# Altium schematic sheet Uno.SchDoc
size A2; SheetNumber: 1; SheetTotal: 1
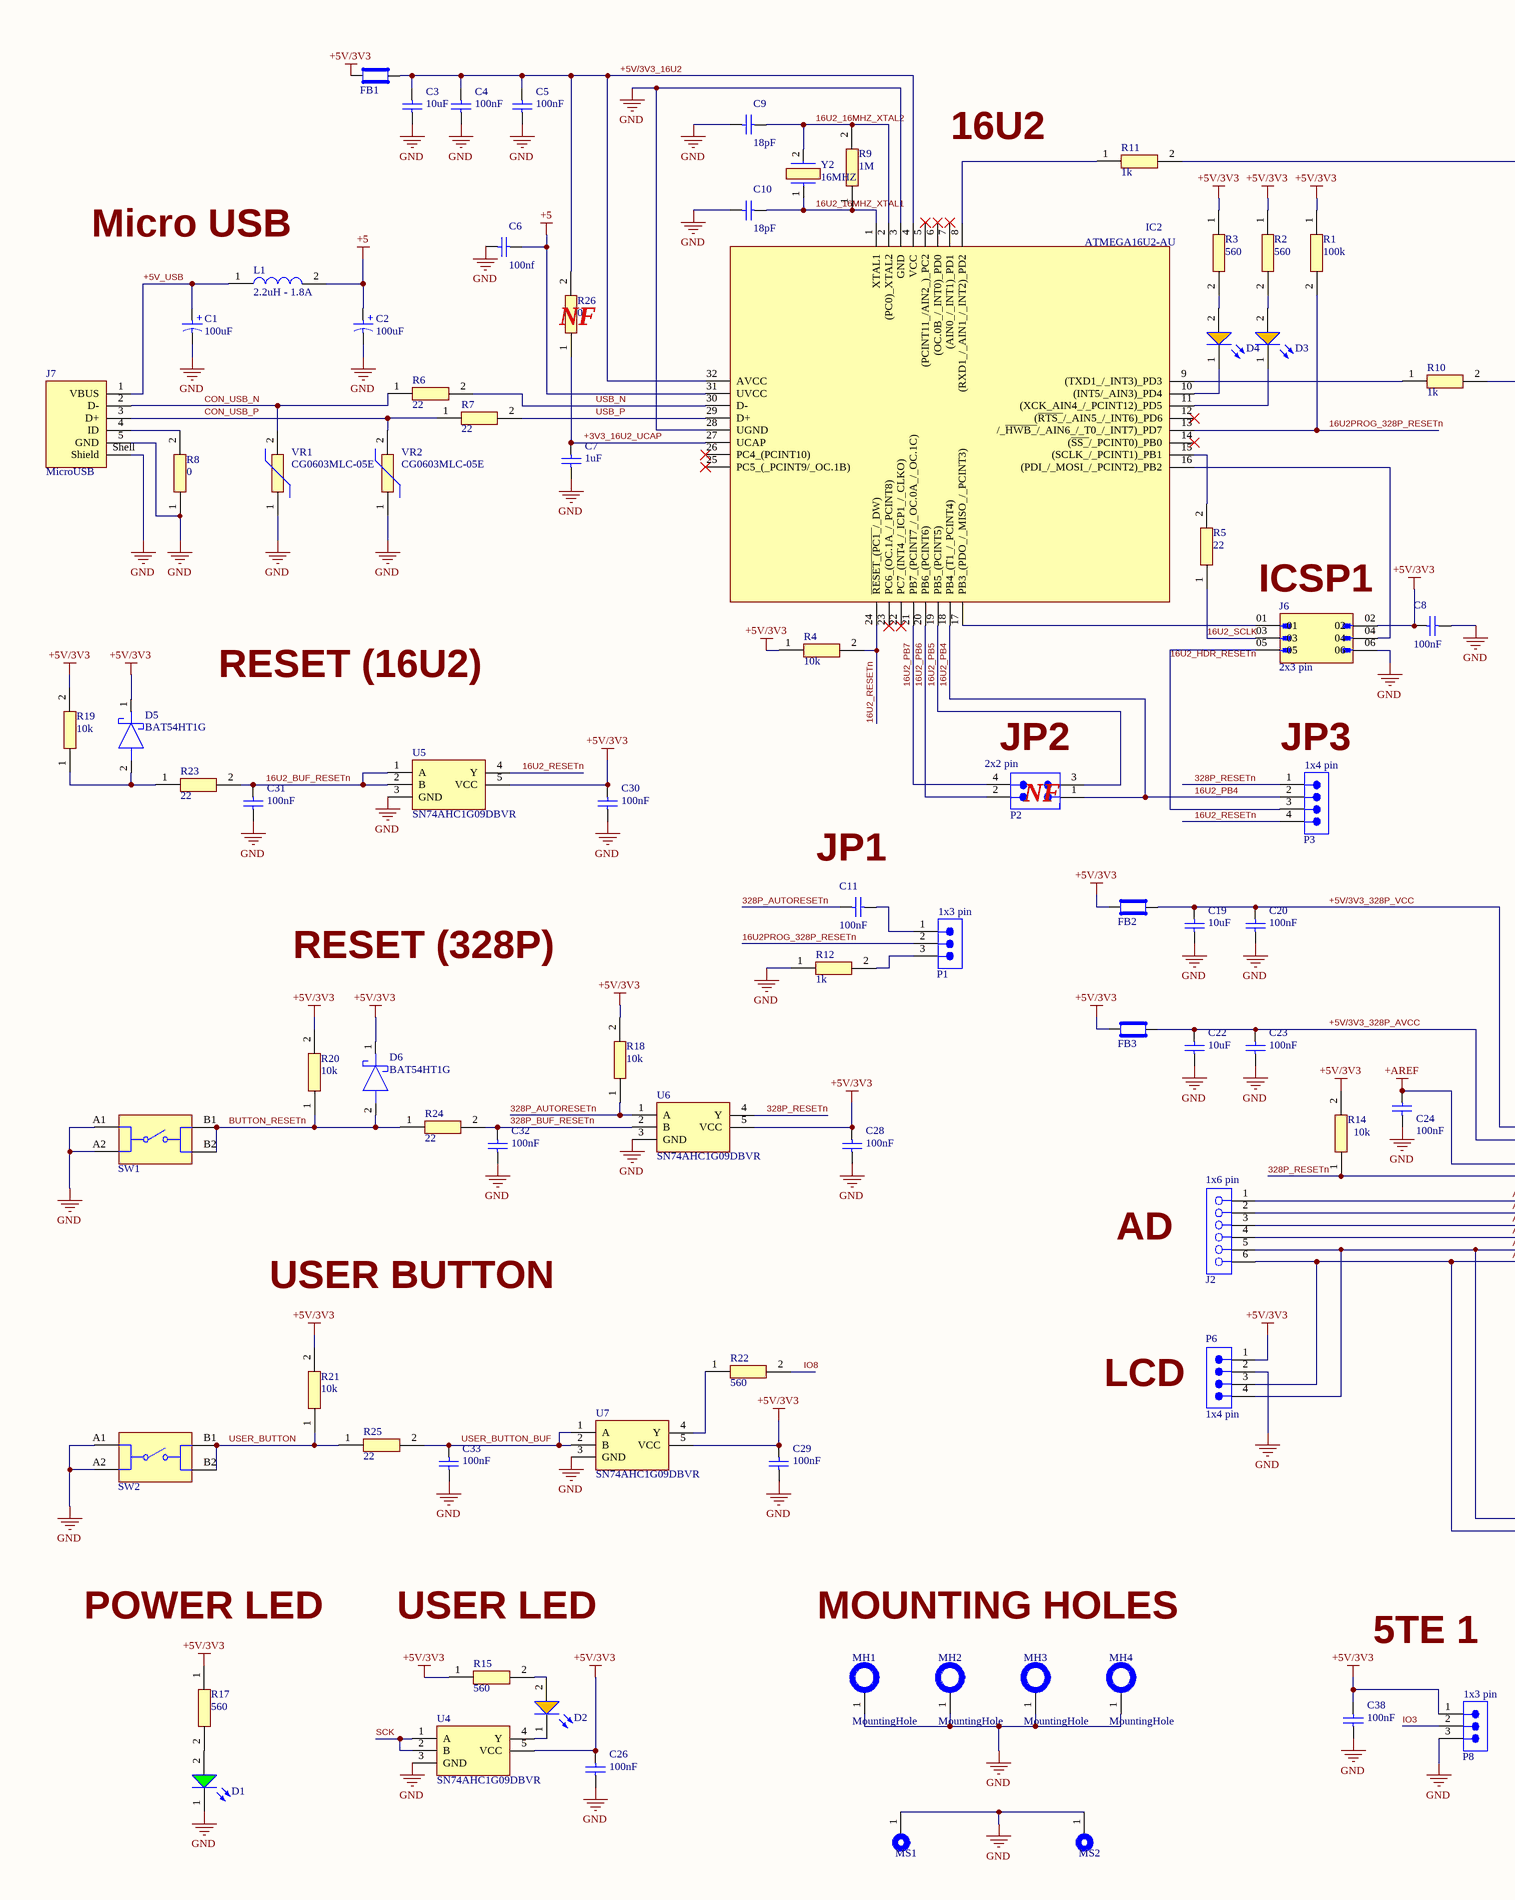
[diagram p0: Uno.SchDoc, left]
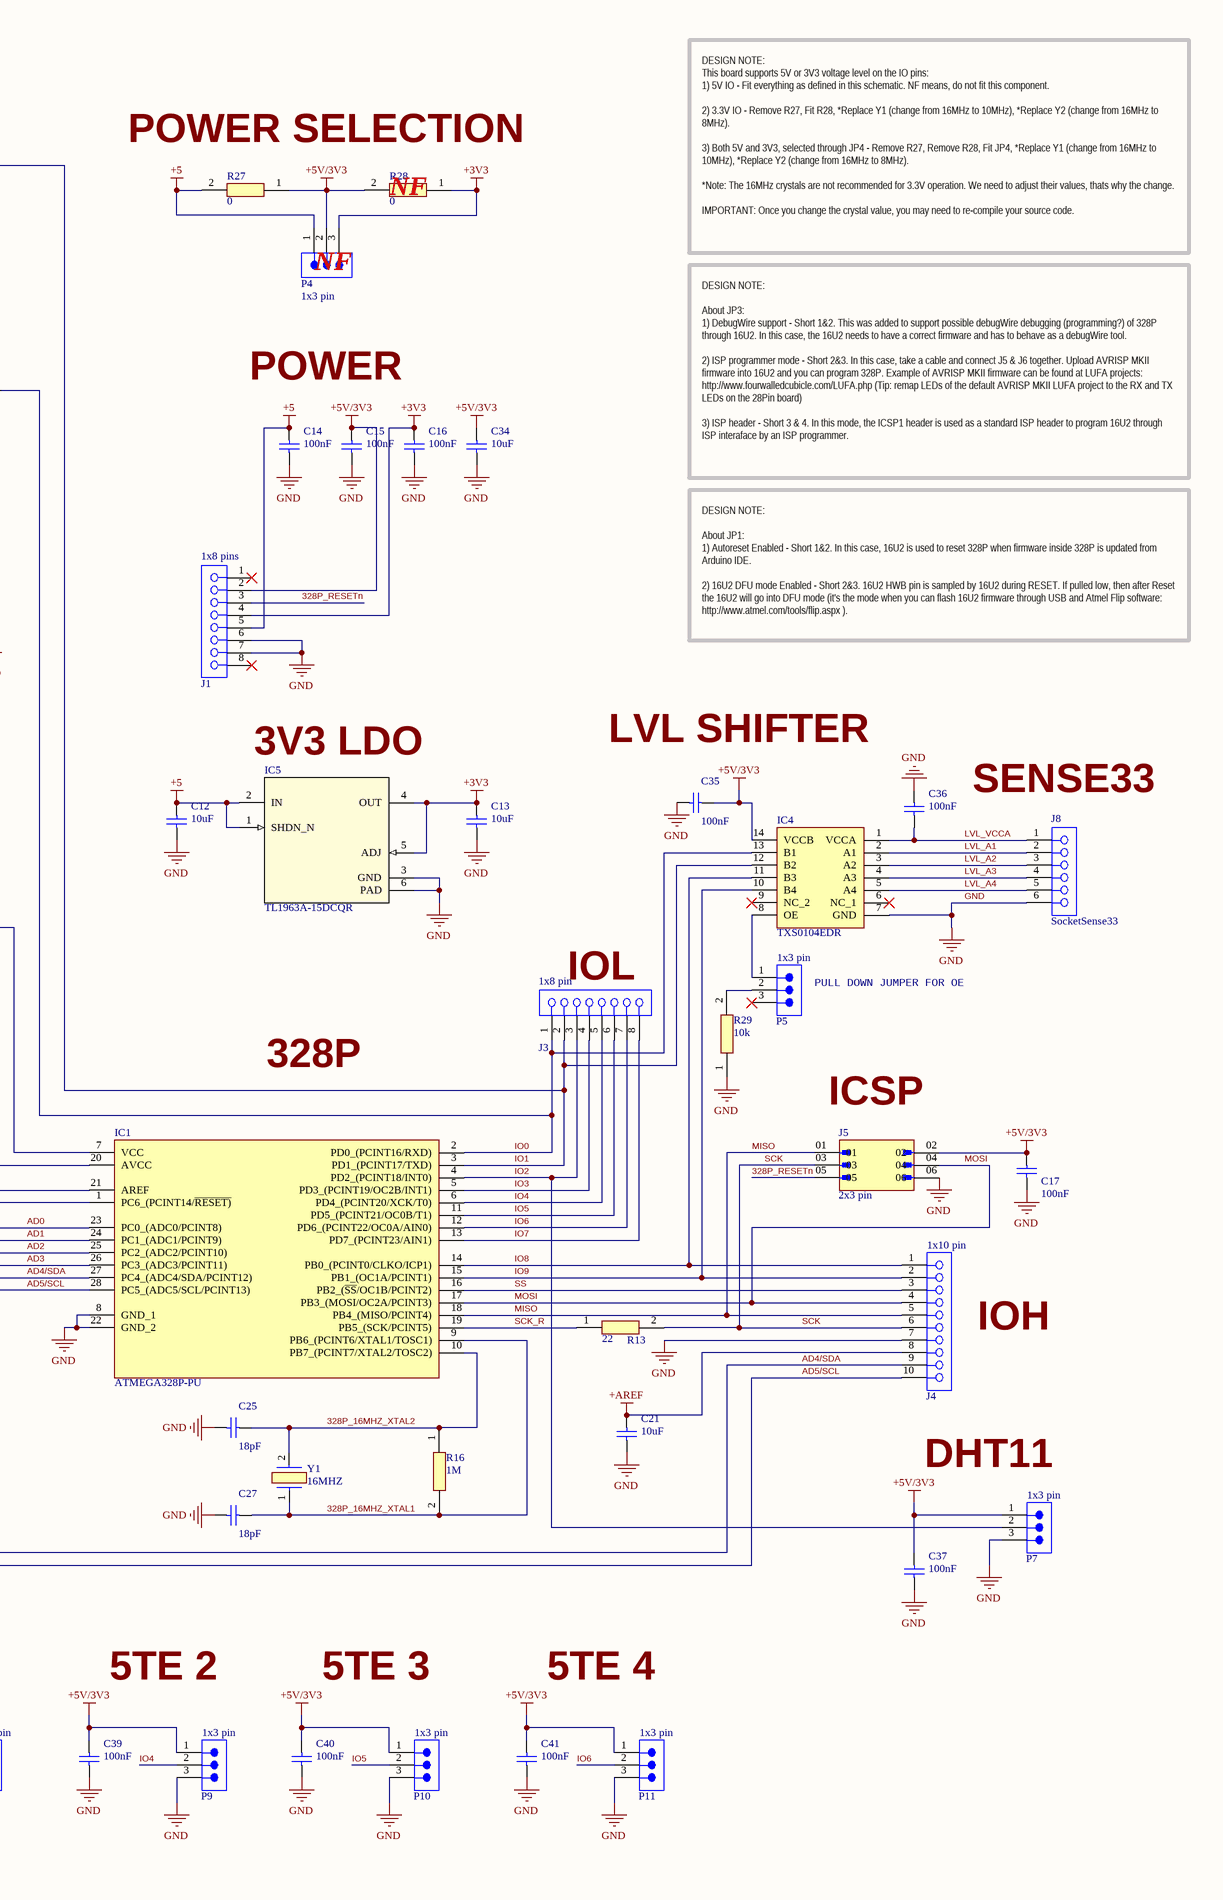
[diagram p1: Uno.SchDoc, right]

## Parts
C1  100uF  [WCAP-ASLI_D6.3H5.5]
C2  100uF  [WCAP-ASLI_D6.3H5.5]
C3  10uF  [WCAP_0805_L2W1.25H0.8]
C4  100nF  [WCAP_0805_L2W1.25H0.8]
C5  100nF  [WCAP_0805_L2W1.25H0.8]
C6  100nf  [WCAP_0805_L2W1.25H0.8]
C7  1uF  [WCAP_0805_L2W1.25H0.8]
C8  100nF  [WCAP_0805_L2W1.25H0.8]
C9  18pF  [WCAP_0805_L2W1.25H0.8]
C10  18pF  [WCAP_0805_L2W1.25H0.8]
C11  100nF  [WCAP_0805_L2W1.25H0.8]
C12  10uF  [WCAP_0805_L2W1.25H0.8]
C13  10uF  [WCAP_0805_L2W1.25H0.8]
C14  100nF  [WCAP_0805_L2W1.25H0.8]
C15  100nF  [WCAP_0805_L2W1.25H0.8]
C16  100nF  [WCAP_0805_L2W1.25H0.8]
C17  100nF  [WCAP_0805_L2W1.25H0.8]
C19  10uF  [WCAP_0805_L2W1.25H0.8]
C20  100nF  [WCAP_0805_L2W1.25H0.8]
C21  10uF  [WCAP_0805_L2W1.25H0.8]
C22  10uF  [WCAP_0805_L2W1.25H0.8]
C23  100nF  [WCAP_0805_L2W1.25H0.8]
C24  100nF  [WCAP_0805_L2W1.25H0.8]
C25  18pF  [WCAP_0805_L2W1.25H0.8]
C26  100nF  [WCAP_0805_L2W1.25H0.8]
C27  18pF  [WCAP_0805_L2W1.25H0.8]
C28  100nF  [WCAP_0805_L2W1.25H0.8]
C29  100nF  [WCAP_0805_L2W1.25H0.8]
C30  100nF  [WCAP_0805_L2W1.25H0.8]
C31  100nF  [WCAP_0805_L2W1.25H0.8]
C32  100nF  [WCAP_0805_L2W1.25H0.8]
C33  100nF  [WCAP_0805_L2W1.25H0.8]
C34  10uF  [WCAP_0805_L2W1.25H0.8]
C35  100nF  [WCAP_0805_L2W1.25H0.8]
C36  100nF  [WCAP_0805_L2W1.25H0.8]
C37  100nF  [WCAP_0805_L2W1.25H0.8]
C38  100nF  [WCAP_0805_L2W1.25H0.8]
C39  100nF  [WCAP_0805_L2W1.25H0.8]
C40  100nF  [WCAP_0805_L2W1.25H0.8]
C41  100nF  [WCAP_0805_L2W1.25H0.8]
D1  Green, 3.2V, 140°  [WL-SMCW_0805_150080xx75000]  (value not drawn)
D2  Amber, 2V, 140°  [WL-SMCW_0805_150080xx75000]  (value not drawn)
D3  Amber, 2V, 140°  [WL-SMCW_0805_150080xx75000]  (value not drawn)
D4  Amber, 2V, 140°  [WL-SMCW_0805_150080xx75000]  (value not drawn)
D5  BAT54HT1G  [SOD2512X110N]
D6  BAT54HT1G  [SOD2512X110N]
FB1  74279204  [WE-CBF_0805_L2W1.2H0.9_HS/WB]  (value not drawn)
FB2  74279204  [WE-CBF_0805_L2W1.2H0.9_HS/WB]  (value not drawn)
FB3  74279204  [WE-CBF_0805_L2W1.2H0.9_HS/WB]  (value not drawn)
IC1  ATMEGA328P-PU  [DIP794W53P254L3467H457Q28N]
IC2  ATMEGA16U2-AU  [QFP80P900X900X120-32N]
IC4  TXS0104EDR  [SOIC127P600X175-14N]
IC5  TL1963A-15DCQR  [DCQ0006A_M]
J1  1x8 pins  [61300811821]
J2  1x6 pin  [61300611821]
J3  1x8 pin  [61300811821]
J4  1x10 pin  [61301011821]
J5  2x3 pin  [AMPHENOL_67997-106HLF]
J6  2x3 pin  [AMPHENOL_67997-106HLF]
J7  MicroUSB  [629105150521]
J8  SocketSense33  [Socket_Sense33]
L1  2.2uH - 1.8A  [RESC2012X50N]
MH1  MountingHole  [Mounting Hole]
MH2  MountingHole  [Mounting Hole]
MH3  MountingHole  [Mounting Hole]
MH4  MountingHole  [Mounting Hole]
MS1  mech_Supp_USB  [Mech_Sup_USB]  (value not drawn)
MS2  mech_Supp_USB  [Mech_Sup_USB]  (value not drawn)
P1  1x3 pin  [61300311121]
P2  2x2 pin  [61300421121]
P3  1x4 pin  [61300411121]
P4  1x3 pin  [61300311121]
P5  1x3 pin  [61300311121]
P6  1x4 pin  [61300411121]
P7  1x3 pin  [61300311121]
P8  1x3 pin  [61300311121]
P9  1x3 pin  [61300311121]
P10  1x3 pin  [61300311121]
P11  1x3 pin  [61300311121]
R1  100k  [RESC2012X50N]
R2  560  [RESC2012X50N]
R3  560  [RESC2012X50N]
R4  10k  [RESC2012X50N]
R5  22  [RESC2012X50N]
R6  22  [RESC2012X50N]
R7  22  [RESC2012X50N]
R8  0  [RESC2012X50N]
R9  1M  [RESC2012X50N]
R10  1k  [RESC2012X50N]
R11  1k  [RESC2012X50N]
R12  1k  [RESC2012X50N]
R13  22  [RESC2012X50N]
R14  10k  [RESC2012X50N]
R15  560  [RESC2012X50N]
R16  1M  [RESC2012X50N]
R17  560  [RESC2012X50N]
R18  10k  [RESC2012X50N]
R19  10k  [RESC2012X50N]
R20  10k  [RESC2012X50N]
R21  10k  [RESC2012X50N]
R22  560  [RESC2012X50N]
R23  22  [RESC2012X50N]
R24  22  [RESC2012X50N]
R25  22  [RESC2012X50N]
R26  0  [RESC2012X50N]
R27  0  [RESC2012X50N]
R28  0  [RESC2012X50N]
R29  10k  [RESC2012X50N]
SW1  430456043736  [4304x60437x6]  (value not drawn)
SW2  430456043736  [4304x60437x6]  (value not drawn)
U4  SN74AHC1G09DBVR  [SOT95P280X145-5N]
U5  SN74AHC1G09DBVR  [SOT95P280X145-5N]
U6  SN74AHC1G09DBVR  [SOT95P280X145-5N]
U7  SN74AHC1G09DBVR  [SOT95P280X145-5N]
VR1  CG0603MLC-05E  [VARC1608X55N]
VR2  CG0603MLC-05E  [VARC1608X55N]
Y1  16MHZ  [ABM7]
Y2  16MHZ  [ABM7]

## Nets
+3V3: C13.2 C16.2 IC5.4(OUT) IC5.5(ADJ) J1.4 P4.3 R28.1
+5: C2.1(P) C6.2 C12.2 C14.2 IC2.31(UVCC) IC5.1(SHDN_N) IC5.2(IN) J1.5 L1.2 P4.1 R27.2
+5V/3V3: C8.2 C15.2 C17.1 C26.2 C28.2 C29.2 C30.2 C34.2 C35.2 C37.2 C38.2 C39.2 C40.2 C41.2 D5.1(K) D6.1(K) FB1.1 FB2.1 FB3.1 IC4.14(VCCB) J1.2 J5.02 J6.02 P4.2 P6.1 P7.1 P8.1 P9.1 P10.1 P11.1 R1.1 R2.1 R3.1 R4.1 R14.2 R15.1 R17.1 R18.2 R19.2 R20.2 R21.2 R27.1 R28.2 U4.5(VCC) U5.5(VCC) U6.5(VCC) U7.5(VCC)
+AREF: C21.2 C24.1 IC1.21(AREF) J4.8
GND: C1.2(N) C2.2(N) C3.1 C4.1 C5.1 C6.1 C7.1 C8.1 C9.1 C10.1 C12.1 C13.1 C14.1 C15.1 C16.1 C17.2 C19.1 C20.1 C21.1 C22.1 C23.1 C24.2 C25.1 C26.1 C27.1 C28.1 C29.1 C30.1 C31.1 C32.1 C33.1 C34.1 C35.1 C36.2 C37.1 C38.1 C39.1 C40.1 C41.1 D1.1(K) IC1.8(GND_1) IC1.22(GND_2) IC2.3(GND) IC2.28(UGND) IC4.7(GND) IC5.3(GND) IC5.6(PAD) J1.6 J1.7 J4.7 J5.06 J6.06 J7.5(GND) J7.Shell(Shield) J8.6 MH1.1 MH2.1 MH3.1 MH4.1 MS1.1 MS2.1 P6.2 P7.3 P8.3 P9.3 P10.3 P11.3 R8.1 R12.1 R29.1 SW1.A1 SW1.A2 SW2.A1 SW2.A2 U4.3(GND) U5.3(GND) U6.3(GND) U7.3(GND) VR1.1 VR2.1
16U2_16MHZ_XTAL1: C10.2 IC2.1(XTAL1) R9.1 Y2.1(X1)
16U2_16MHZ_XTAL2: C9.2 IC2.2((PC0)_XTAL2) R9.2 Y2.2(X2)
16U2_BUF_RESETn: C31.2 R23.2 U5.1(A) U5.2(B)
16U2_HDR_RESETn: J6.05 P3.3
16U2_PB4: IC2.18(PB4_(T1_/_PCINT4)) P2.1 P3.2
16U2_PB5: IC2.19(PB5_(PCINT5)) P2.3
16U2_PB6: IC2.20(PB6_(PCINT6)) P2.2
16U2_PB7: IC2.21(PB7_(PCINT7_/_OC.0A_/_OC.1C)) P2.4
16U2_RESETn: IC2.24(~{RESET_(PC1_}/_DW)) P3.4 R4.2 U5.4(Y)
16U2_SCLK: J6.03 R5.1
16U2PROG_328P_RESETn: IC2.13(/_~{HWB_}/_AIN6_/_T0_/_INT7)_PD7) P1.2 R1.2
328P_16MHZ_XTAL1: C27.2 IC1.9(PB6_(PCINT6/XTAL1/TOSC1)) R16.2 Y1.1(X1)
328P_16MHZ_XTAL2: C25.2 IC1.10(PB7_(PCINT7/XTAL2/TOSC2)) R16.1 Y1.2(X2)
328P_AUTORESETn: C11.2 R18.1 U6.1(A)
328P_BUF_RESETn: C32.2 R24.2 U6.2(B)
328P_RESETn: IC1.1(PC6_(PCINT14/~{RESET)}) J1.3 J5.05 P3.1 R14.1 U6.4(Y)
+3V3_16U2_UCAP: C7.2 IC2.27(UCAP) R26.1
+5V/3V3_16U2: C3.2 C4.2 C5.2 FB1.2 IC2.4(VCC) IC2.32(AVCC) R26.2
+5V/3V3_328P_AVCC: C22.2 C23.2 FB3.2 IC1.20(AVCC)
+5V/3V3_328P_VCC: C19.2 C20.2 FB2.2 IC1.7(VCC)
+5V_USB: C1.1(P) J7.1(VBUS) L1.1
AD0: IC1.23(PC0_(ADC0/PCINT8)) J2.1
AD1: IC1.24(PC1_(ADC1/PCINT9)) J2.2
AD2: IC1.25(PC2_(ADC2/PCINT10)) J2.3
AD3: IC1.26(PC3_(ADC3/PCINT11)) J2.4
AD4/SDA: IC1.27(PC4_(ADC4/SDA/PCINT12)) J2.5 J4.9 P6.4
AD5/SCL: IC1.28(PC5_(ADC5/SCL/PCINT13)) J2.6 J4.10 P6.3
BUTTON_RESETn: D6.2(A) R20.1 R24.1 SW1.B1 SW1.B2
CON_USB_N: J7.2(D-) R6.1 VR1.2
CON_USB_P: J7.3(D+) R7.1 VR2.2
IO0: IC1.2(PD0_(PCINT16/RXD)) IC4.13(B1) J3.1 R10.2
IO1: IC1.3(PD1_(PCINT17/TXD)) IC4.12(B2) J3.2 R11.2
IO2: IC1.4(PD2_(PCINT18/INT0)) J3.3 P7.2
IO3: IC1.5(PD3_(PCINT19/OC2B/INT1)) J3.4 P8.2
IO4: IC1.6(PD4_(PCINT20/XCK/T0)) J3.5 P9.2
IO5: IC1.11(PD5_(PCINT21/OC0B/T1)) J3.6 P10.2
IO6: IC1.12(PD6_(PCINT22/OC0A/AIN0)) J3.7 P11.2
IO7: IC1.13(PD7_(PCINT23/AIN1)) J3.8
IO8: IC1.14(PB0_(PCINT0/CLKO/ICP1)) IC4.11(B3) J4.1 R22.2
IO9: IC1.15(PB1_(OC1A/PCINT1)) IC4.10(B4) J4.2
LVL_A1: IC4.2(A1) J8.2
LVL_A2: IC4.3(A2) J8.3
LVL_A3: IC4.4(A3) J8.4
LVL_A4: IC4.5(A4) J8.5
LVL_VCCA: C36.1 IC4.1(VCCA) J8.1
MISO: IC1.18(PB4_(MISO/PCINT4)) J4.5 J5.01
MOSI: IC1.17(PB3_(MOSI/OC2A/PCINT3)) J4.4 J5.04
SCK: J4.6 J5.03 R13.2 U4.1(A) U4.2(B)
SCK_R: IC1.19(PB5_(SCK/PCINT5)) R13.1
SS: IC1.16(PB2_(~{SS}/OC1B/PCINT2)) J4.3
USB_N: IC2.30(D-) R6.2
USB_P: IC2.29(D+) R7.2
USER_BUTTON: R21.1 R25.1 SW2.B1 SW2.B2
USER_BUTTON_BUF: C33.2 R25.2 U7.1(A) U7.2(B)
NetC11_1: C11.1 P1.1
NetD1_2: D1.2(A) R17.2
NetD2_1: D2.1(K) U4.4(Y)
NetD2_2: D2.2(A) R15.2
NetD3_1: D3.1(K) IC2.11((XCK_AIN4_/_PCINT12)_PD5)
NetD3_2: D3.2(A) R2.2
NetD4_1: D4.1(K) IC2.10((INT5/_AIN3)_PD4)
NetD4_2: D4.2(A) R3.2
NetD5_2: D5.2(A) R19.1 R23.1
NetIC2_8: IC2.8((RXD1_/_AIN1_/_INT2)_PD2) R11.1
NetIC2_9: IC2.9((TXD1_/_INT3)_PD3) R10.1
NetIC2_15: IC2.15((SCLK_/_PCINT1)_PB1) R5.2
NetIC2_16: IC2.16((PDI_/_MOSI_/_PCINT2)_PB2) J6.04
NetIC2_17: IC2.17(PB3_(PDO_/_MISO_/_PCINT3)) J6.01
NetIC4_8: IC4.8(OE) P5.1
NetJ7_4: J7.4(ID) R8.2
NetP1_3: P1.3 R12.2
NetP5_2: P5.2 R29.2
NetR22_1: R22.1 U7.4(Y)

Not connected (* = marked no-connect by the designer): IC2 5((PCINT11_/AIN2_)_PC2)* 6((OC.0B_/_INT0)_PD0)* 7((AIN0_/_INT1)_PD1)* 12((~{RTS_}/_AIN5_/_INT6)_PD6)* 14((~{SS_}/_PCINT0)_PB0)* 22(PC7_(INT4_/_ICP1_/_CLKO))* 23(PC6_(OC.1A_/_PCINT8))* 25(PC5_(_PCINT9/_OC.1B))* 26(PC4_(PCINT10))*; IC4 6(NC_1)* 9(NC_2)*; J1 1* 8*; P5 3*

## Notes on the sheet
- 16U2
- POWER SELECTION
- (near R28) NF
- (near L1) Micro USB
- (near P4) NF
- DESIGN NOTE:
  This board supports 5V or 3V3 voltage level on the IO pins:
  1) 5V IO - Fit everything as defined in this schematic. NF means, do not fit this component.
  2) 3.3V IO - Remove R27, Fit R28, *Replace Y1 (change from 16MHz to 10MHz), *Replace Y2 (change from 16MHz to 8MHz).
  3) Both 5V and 3V3, selected through JP4 - Remove R27, Remove R28, Fit JP4, *Replace Y1 (change from 16MHz to 10MHz), *Replace Y2 (change from 16MHz to 8MHz).
  *Note: The 16MHz crystals are not recommended for 3.3V operation. We need to adjust their values, thats why the change.
  IMPORTANT: Once you change the crystal value, you may need to re-compile your source code.
- (near R26) NF
- POWER
- DESIGN NOTE:
  About JP3:
  1) DebugWire support - Short 1&2. This was added to support possible debugWire debugging (programming?) of 328P through 16U2. In this case, the 16U2 needs to have a correct firmware and has to behave as a debugWire tool.
  2) ISP programmer mode - Short 2&3. In this case, take a cable and connect J5 & J6 together. Upload AVRISP MKII firmware into 16U2 and you can program 328P. Example of AVRISP MKII firmware can be found at LUFA projects: http://www.fourwalledcubicle.com/LUFA.php (Tip: remap LEDs of the default AVRISP MKII LUFA project to the RX and TX LEDs on the 28Pin board)
  3) ISP header - Short 3 & 4. In this mode, the ICSP1 header is used as a standard ISP header to program 16U2 through ISP interaface by an ISP programmer.
- (near J6) ICSP1
- DESIGN NOTE:
  About JP1:
  1) Autoreset Enabled - Short 1&2. In this case, 16U2 is used to reset 328P when firmware inside 328P is updated from Arduino IDE.
  2) 16U2 DFU mode Enabled - Short 2&3. 16U2 HWB pin is sampled by 16U2 during RESET. If pulled low, then after Reset the 16U2 will go into DFU mode (it's the mode when you can flash 16U2 firmware through USB and Atmel Flip software: http://www.atmel.com/tools/flip.aspx ).
- RESET (16U2)
- (near P2) JP2
- (near P3) JP3
- (near IC5) 3V3 LDO
- LVL SHIFTER
- (near P2) NF
- (near J8) SENSE33
- (near C11) JP1
- RESET (328P)
- (near J3) IOL
- (near P5) PULL DOWN JUMPER FOR OE
- 328P
- (near J5) ICSP
- AD
- USER BUTTON
- IOH
- LCD
- DHT11
- POWER LED
- USER LED
- MOUNTING HOLES
- 5TE 1
- 5TE 2
- 5TE 3
- 5TE 4
- (in symbol 865080243007) +

## Library data of the parts
C1 C2 = 865080243007: WCAP-ASLI Aluminum Electrolytic Capacitor, V-Chip, D6.3 x H5.5mm, 100uF, 10V; Manufacturer: Wurth Elektronik; Capacitance Tolerance: +/-20%; Dissipation Factor: 19%; Endurance: 2000h; Leakage Current: 10uA; Ripple Current: 240mA; Technical Reference: ASED055101M010DVCTBB000; Manufacturer Part Number: 865080243007; Category: Aluminum Electrolytic Capacitors; Match Code: WCAP-ASLI; ComponentLink1Description: Website Link; ComponentLink1URL: https://www.we-online.com/redexpert/article/865080243007?ad; ComponentLink2Description: Datasheet Link; ComponentLink2URL: https://www.we-online.com/redexpert/spec/865080243007?ad; Mount: Surface Mount; Operating Temperature Max: 105°C; Operating Temperature Min: -55°C; Packaging: Tape and Reel; Height: 5.5mm; Diameter: 6.3mm; Capacitance: 100uF; Rated Voltage (DC): 10V
C3-C17 C19-C41 = CeramicCap: Manufacturer Part Number: 885012004001; Manufacturer: Wurth Elektronik; Match Code: WCAP-CSGP; Case/Size Code: 0201; Capacitance: 100pF; Capacitance Tolerance: +/-5%; Ceramic Type: NP0 Class I; Insulation Resistance: 10GOhm; Q Factor: 1000; Rated Voltage (DC): 25V; Technical Reference: NP00201101J025DFCT10000; Height: 0.3mm; Category: Multilayer Ceramic Chip Capacitors; ComponentLink1Description: Website Link; ComponentLink1URL: https://www.we-online.com/redexpert/article/885012004001?ad; ComponentLink2Description: Datasheet Link; ComponentLink2URL: https://www.we-online.com/redexpert/spec/885012004001?ad; Mount: Surface Mount; Operating Temperature Max: 125°C; Operating Temperature Min: -55°C; Packaging: Tape and Reel; Length: 0.6mm; Width: 0.3mm
D1 = 150080GS75000: WL-SMCW Mono-color Chip LED Waterclear, size 0805, Green, 3.2V, 140°; Manufacturer: Wurth Elektronik; Case/Size Code: 0805; Chip Technology: InGaN; Dominant Wavelength: 525nm; Luminous Intensity: 450mcd; Peak Wavelength: 515nm; Manufacturer Part Number: 150080GS75000; Category: Signal LEDs; Match Code: WL-SMCW; ComponentLink1Description: Website Link; ComponentLink1URL: https://www.we-online.com/redexpert/article/150080GS75000?ad; ComponentLink2Description: Datasheet Link; ComponentLink2URL: https://www.we-online.com/redexpert/spec/150080GS75000?ad; Mount: Surface Mount; Operating Temperature Max: 85°C; Operating Temperature Min: -40°C; Packaging: Tape and Reel; Length: 2mm; Width: 1.25mm; Height: 0.7mm; Emitting Color: Green; Forward Voltage: 3.2V; Viewing Angle: 140°
D2-D4 = 150080AS75000: WL-SMCW Mono-color Chip LED Waterclear, size 0805, Amber, 2V, 140°; Manufacturer: Wurth Elektronik; Case/Size Code: 0805; Chip Technology: AlInGaP; Dominant Wavelength: 605nm; Luminous Intensity: 130mcd; Peak Wavelength: 610nm; Manufacturer Part Number: 150080AS75000; Category: Signal LEDs; Match Code: WL-SMCW; ComponentLink1Description: Website Link; ComponentLink1URL: https://www.we-online.com/redexpert/article/150080AS75000?ad; ComponentLink2Description: Datasheet Link; ComponentLink2URL: https://www.we-online.com/redexpert/spec/150080AS75000?ad; Mount: Surface Mount; Operating Temperature Max: 85°C; Operating Temperature Min: -40°C; Packaging: Tape and Reel; Length: 2mm; Width: 1.25mm; Height: 0.7mm; Emitting Color: Amber; Forward Voltage: 2V; Viewing Angle: 140°
D5 D6 = BAT54HT1G: Diode Shotkey; Manufacturer_Name: onsemi; Datasheet Link: https://componentsearchengine.com/Datasheets/2/BAT54HT1G.pdf; Height: 1.1mm; Manufacturer_Part_Number: BAT54HT1G; Mouser Part Number: 863-BAT54HT1G; Mouser Price/Stock: https://www.mouser.co.uk/ProductDetail/onsemi/BAT54HT1G?qs=vLkC5FC1VN%252BK3ZQA%252ByHPIA%3D%3D; Arrow Part Number: BAT54HT1G; Arrow Price/Stock: https://www.arrow.com/en/products/bat54ht1g/on-semiconductor?region=nac
FB1-FB3 = 74279204: WE-CBF SMT EMI Suppression Ferrite Bead, size 0805, 600Ohm, 1.5A; Manufacturer: Wurth Elektronik; Case/Size Code: 0805; DC Resistance Max: 0.35Ohm; Impedance Max: 700Ohm; Impedance Max Test Condition: 150MHz; Type: Wide Band; Manufacturer Part Number: 74279204; Category: Ferrites for PCB Assembly; Match Code: WE-CBF; ComponentLink1Description: Website Link; ComponentLink1URL: https://www.we-online.com/redexpert/article/74279204?ad; ComponentLink2Description: Datasheet Link; ComponentLink2URL: https://www.we-online.com/redexpert/spec/74279204?ad; Mount: Surface Mount; Operating Temperature Max: 125°C; Operating Temperature Min: -55°C; Packaging: Tape and Reel; Length: 2mm; Width: 1.2mm; Height: 0.9mm; Impedance @100MHz: 600Ohm; Rated Current: 1.5A
IC1 = ATMEGA328P-PU: MICROCHIP - ATMEGA328P-PU. - MICROCONTROLLER MCU, 8 BIT, ATMEGA, 20MHZ, DIP-28; Geometry.Height: 4.572mm; Mouser Part Number: 556-ATMEGA328P-PU; Mouser Price/Stock: https://www.mouser.co.uk/ProductDetail/Microchip-Technology/ATMEGA328P-PU?qs=K8BHR703ZXguOQv3sKbWcg%3D%3D; Manufacturer_Name: Microchip; Manufacturer_Part_Number: ATMEGA328P-PU; Datasheet Link: https://www.mouser.ca/datasheet/2/268/ATmega48A_PA_88A_PA_168A_PA_328_P_DS_DS40002061B-3050139.pdf
IC2 = ATMEGA16U2-AU: Integrated Circuit; Manufacturer_Name: Microchip; Datasheet Link: http://www.atmel.com/images/doc7799.pdf; Height: 1.2mm; Manufacturer_Part_Number: ATMEGA16U2-AU; Mouser Part Number: 556-ATMEGA16U2-AU; Mouser Price/Stock: https://www.mouser.co.uk/ProductDetail/Microchip-Technology/ATMEGA16U2-AU?qs=JV7lzlMm3yJerHSPc%2FAMcA%3D%3D; Arrow Part Number: ATMEGA16U2-AU; Arrow Price/Stock: https://www.arrow.com/en/products/atmega16u2-au/microchip-technology?region=europe
IC4 = TXS0104EDR: Integrated Circuit; Manufacturer_Name: Texas Instruments; Datasheet Link: http://www.ti.com/lit/gpn/txs0104e; Height: 1.75mm; Manufacturer_Part_Number: TXS0104EDR; Mouser Part Number: 595-TXS0104EDR; Mouser Price/Stock: https://www.mouser.co.uk/ProductDetail/Texas-Instruments/TXS0104EDR?qs=7kv20MEVUljeQYQBZTsYxg%3D%3D; Arrow Part Number: TXS0104EDR; Arrow Price/Stock: https://www.arrow.com/en/products/txs0104edr/texas-instruments?region=nac
IC5 = TL1963A-15DCQR: 3v3 LDO; Mfr_Name: Texas Instruments; PartNumber: TL1963ADCQR; Alternate_PartNumber: TL1963ADCQT; CompType: IC; TYPE: TYPE; RefDes: RefDes; Application_BuildNumber: *; PackageReference: DCQ0006A; MountType: SMT; RoHS: Y; Manufacturer: Texas Instruments
J1 J3 = 61300811821: 61300811821 WR-PHD Socket Header, THT, Vertical, pitch 2.54mm, 1 Row, 8P; Manufacturer: Wurth Elektronik; Contact Resistance: 20mOhm; Rated Current: 3A; Working Voltage: 250V; Withstanding Voltage: 500V; Manufacturer Part Number: 61300811821; Category: Board-to-Board Connectors; Match Code: WR-PHD; ComponentLink1Description: Website Link; ComponentLink1URL: https://www.we-online.com/redexpert/article/61300811821?ad; ComponentLink2Description: Datasheet Link; ComponentLink2URL: https://www.we-online.com/redexpert/spec/61300811821?ad; Mount: Through Hole; Operating Temperature Max: 125°C; Operating Temperature Min: -40°C; Packaging: Tray; Gender: Socket Header; Number of Pins: 8; Number of Rows: 1; Orientation: Vertical; Pitch: 2.54mm
J2 = 61300611821: 61300611821 WR-PHD Socket Header, THT, Vertical, pitch 2.54mm, 1 Row, 6P; Manufacturer: Wurth Elektronik; Contact Resistance: 20mOhm; Rated Current: 3A; Working Voltage: 250V; Withstanding Voltage: 500V; Manufacturer Part Number: 61300611821; Category: Board-to-Board Connectors; Match Code: WR-PHD; ComponentLink1Description: Website Link; ComponentLink1URL: https://www.we-online.com/redexpert/article/61300611821?ad; ComponentLink2Description: Datasheet Link; ComponentLink2URL: https://www.we-online.com/redexpert/spec/61300611821?ad; Mount: Through Hole; Operating Temperature Max: 125°C; Operating Temperature Min: -40°C; Packaging: Tray; Gender: Socket Header; Number of Pins: 6; Number of Rows: 1; Orientation: Vertical; Pitch: 2.54mm
J4 = 61301011821: 61301011821 WR-PHD Socket Header, THT, Vertical, pitch 2.54mm, 1 Row, 10P; Manufacturer: Wurth Elektronik; Contact Resistance: 20mOhm; Rated Current: 3A; Working Voltage: 250V; Withstanding Voltage: 500V; Manufacturer Part Number: 61301011821; Category: Board-to-Board Connectors; Match Code: WR-PHD; ComponentLink1Description: Website Link; ComponentLink1URL: https://www.we-online.com/redexpert/article/61301011821?ad; ComponentLink2Description: Datasheet Link; ComponentLink2URL: https://www.we-online.com/redexpert/spec/61301011821?ad; Mount: Through Hole; Operating Temperature Max: 105°C; Operating Temperature Min: -40°C; Packaging: Tray; Gender: Socket Header; Number of Pins: 10; Number of Rows: 1; Orientation: Vertical; Pitch: 2.54mm
J5 J6 = 67997-106HLF: 67997-106HLF BergStikÂ®, Board to Board connector, Unshrouded vertical header, Through Hole, Double Row, 6 Positions, 2.54 mm (0.100in) Pitch; MF: Amphenol ICC; Availability: In Stock; Purchase-URL: https://pricing.snapeda.com/search/part/67997-106HLF/?ref=eda; Package: None; SnapEDA_Link: https://www.snapeda.com/parts/67997-106HLF/Amphenol+FCI/view-part/?ref=snap; MP: 67997-106HLF; Check_prices: https://www.snapeda.com/parts/67997-106HLF/Amphenol+FCI/view-part/?ref=eda; Price: None; Value: *
J7 = 629105150521: 629105150521 WR-COM Micro USB 2.0 SMT Type B Horizontal 5 Contacts High Current; Manufacturer: Wurth Elektronik; Match Code: WR-USB; Gender: Receptacle; Interface Type: Type B; Number of Ports: 1; Rated Current: 3A; Working Voltage: 30V (AC); Manufacturer Part Number: 629105150521; Category: Input/Output Connectors; ComponentLink1Description: Website Link; ComponentLink1URL: https://www.we-online.com/redexpert/article/629105150521?ad; ComponentLink2Description: Datasheet Link; ComponentLink2URL: https://www.we-online.com/redexpert/spec/629105150521?ad; Mount: Surface Mount; Operating Temperature Max: 85°C; Operating Temperature Min: -40°C; Packaging: Tape and Reel; Application: Micro USB 2.0; Number of Pins: 5; Orientation: Horizontal
L1 = Power Inductor: Power Inductors - SMD 0805 2.2uH 20%; Manufacturer_Name: Bourns; Manufacturer_Part_Number: CI160808-R10J; Mouser Part Number: 652-CI160808-R10J; Mouser Price/Stock: https://www.mouser.co.uk/ProductDetail/Bourns/CI160808-R10J?qs=uD%2FoUDWqfvSQYk45NmNjYw%3D%3D; Arrow Part Number: CI160808-R10J; Arrow Price/Stock: https://www.arrow.com/en/products/ci160808-r10j/bourns
P1 P4 P5 P7-P11 = 61300311121: 61300311121 WR-PHD Pin Header, THT, Vertical, pitch 2.54mm, 1 Row, 3P; Manufacturer: Wurth Elektronik; Contact Resistance: 20mOhm; Rated Current: 3A; Working Voltage: 250V; Withstanding Voltage: 500V; Manufacturer Part Number: 61300311121; Category: Board-to-Board Connectors; Match Code: WR-PHD; ComponentLink1Description: Website Link; ComponentLink1URL: https://www.we-online.com/redexpert/article/61300311121?ad; ComponentLink2Description: Datasheet Link; ComponentLink2URL: https://www.we-online.com/redexpert/spec/61300311121?ad; Mount: Through Hole; Operating Temperature Max: 105°C; Operating Temperature Min: -40°C; Packaging: Bag; Gender: Pin Header; Number of Pins: 3; Number of Rows: 1; Orientation: Vertical; Pitch: 2.54mm
P2 = 61300421121: 61300421121 WR-PHD Pin Header, THT, Vertical, pitch 2.54mm, 2 Row, 4P; Manufacturer: Wurth Elektronik; Contact Resistance: 20mOhm; Rated Current: 3A; Working Voltage: 250V; Withstanding Voltage: 500V; Manufacturer Part Number: 61300421121; Category: Board-to-Board Connectors; Match Code: WR-PHD; ComponentLink1Description: Website Link; ComponentLink1URL: https://www.we-online.com/redexpert/article/61300421121?ad; ComponentLink2Description: Datasheet Link; ComponentLink2URL: https://www.we-online.com/redexpert/spec/61300421121?ad; Mount: Through Hole; Operating Temperature Max: 105°C; Operating Temperature Min: -40°C; Packaging: Bag; Gender: Pin Header; Number of Pins: 4; Number of Rows: 2; Orientation: Vertical; Pitch: 2.54mm
P3 P6 = 61300411121: 61300411121 WR-PHD Pin Header, THT, Vertical, pitch 2.54mm, 1 Row, 4P; Manufacturer: Wurth Elektronik; Contact Resistance: 20mOhm; Rated Current: 3A; Working Voltage: 250V; Withstanding Voltage: 500V; Manufacturer Part Number: 61300411121; Category: Board-to-Board Connectors; Match Code: WR-PHD; ComponentLink1Description: Website Link; ComponentLink1URL: https://www.we-online.com/redexpert/article/61300411121?ad; ComponentLink2Description: Datasheet Link; ComponentLink2URL: https://www.we-online.com/redexpert/spec/61300411121?ad; Mount: Through Hole; Operating Temperature Max: 105°C; Operating Temperature Min: -40°C; Packaging: Bag; Gender: Pin Header; Number of Pins: 4; Number of Rows: 1; Orientation: Vertical; Pitch: 2.54mm
R1 = Resistor0805: Resistor 100k; Manufacturer_Name: Vishay; Manufacturer_Part_Number: AC05000004707JAC00; Datasheet Link: https://www.vishay.com/docs/28730/acac-at.pdf; Mouser Part Number: 594-AC05W0R470J; Mouser Price/Stock: https://www.mouser.co.uk/ProductDetail/Vishay-Draloric/AC05000004707JAC00?qs=9EcTHFQkrt89eb2J9Rg7Vw%3D%3D; Arrow Part Number: AC05000004707JAC00; Arrow Price/Stock: https://www.arrow.com/en/products/ac05000004707jac00/vishay
R2 R3 R15 R17 R22 = Resistor0805: Resistor 560 Ohm; Manufacturer_Name: Vishay; Manufacturer_Part_Number: AC05000004707JAC00; Datasheet Link: https://www.vishay.com/docs/28730/acac-at.pdf; Mouser Part Number: 594-AC05W0R470J; Mouser Price/Stock: https://www.mouser.co.uk/ProductDetail/Vishay-Draloric/AC05000004707JAC00?qs=9EcTHFQkrt89eb2J9Rg7Vw%3D%3D; Arrow Part Number: AC05000004707JAC00; Arrow Price/Stock: https://www.arrow.com/en/products/ac05000004707jac00/vishay
R4 R10-R12 R14 R18-R21 R29 = Resistor0805: Resistor 10k; Manufacturer_Name: Vishay; Manufacturer_Part_Number: AC05000004707JAC00; Datasheet Link: https://www.vishay.com/docs/28730/acac-at.pdf; Mouser Part Number: 594-AC05W0R470J; Mouser Price/Stock: https://www.mouser.co.uk/ProductDetail/Vishay-Draloric/AC05000004707JAC00?qs=9EcTHFQkrt89eb2J9Rg7Vw%3D%3D; Arrow Part Number: AC05000004707JAC00; Arrow Price/Stock: https://www.arrow.com/en/products/ac05000004707jac00/vishay
R5 = Resistor0805: Resistor 22; Manufacturer_Name: Vishay; Manufacturer_Part_Number: AC05000004707JAC00; Datasheet Link: https://www.vishay.com/docs/28730/acac-at.pdf; Mouser Part Number: 594-AC05W0R470J; Mouser Price/Stock: https://www.mouser.co.uk/ProductDetail/Vishay-Draloric/AC05000004707JAC00?qs=9EcTHFQkrt89eb2J9Rg7Vw%3D%3D; Arrow Part Number: AC05000004707JAC00; Arrow Price/Stock: https://www.arrow.com/en/products/ac05000004707jac00/vishay
R6 R7 R13 R23-R25 = Resistor0805: Resistor 22Ohm; Manufacturer_Name: Vishay; Manufacturer_Part_Number: AC05000004707JAC00; Datasheet Link: https://www.vishay.com/docs/28730/acac-at.pdf; Mouser Part Number: 594-AC05W0R470J; Mouser Price/Stock: https://www.mouser.co.uk/ProductDetail/Vishay-Draloric/AC05000004707JAC00?qs=9EcTHFQkrt89eb2J9Rg7Vw%3D%3D; Arrow Part Number: AC05000004707JAC00; Arrow Price/Stock: https://www.arrow.com/en/products/ac05000004707jac00/vishay
R8 R26-R28 = Resistor0805: Resistor 0 Ohm; Manufacturer_Name: Vishay; Manufacturer_Part_Number: AC05000004707JAC00; Datasheet Link: https://www.vishay.com/docs/28730/acac-at.pdf; Mouser Part Number: 594-AC05W0R470J; Mouser Price/Stock: https://www.mouser.co.uk/ProductDetail/Vishay-Draloric/AC05000004707JAC00?qs=9EcTHFQkrt89eb2J9Rg7Vw%3D%3D; Arrow Part Number: AC05000004707JAC00; Arrow Price/Stock: https://www.arrow.com/en/products/ac05000004707jac00/vishay
R9 R16 = Resistor0805: Resistor 1M; Manufacturer_Name: Vishay; Manufacturer_Part_Number: AC05000004707JAC00; Datasheet Link: https://www.vishay.com/docs/28730/acac-at.pdf; Mouser Part Number: 594-AC05W0R470J; Mouser Price/Stock: https://www.mouser.co.uk/ProductDetail/Vishay-Draloric/AC05000004707JAC00?qs=9EcTHFQkrt89eb2J9Rg7Vw%3D%3D; Arrow Part Number: AC05000004707JAC00; Arrow Price/Stock: https://www.arrow.com/en/products/ac05000004707jac00/vishay
SW1 SW2 = 430456043736: 430456043736 WS-TATV THT Washable Tact Switch 12x12mm, SPST-NO, 12VDC, 50mA, 360g; Manufacturer: Wurth Elektronik; Washable: Yes; ComponentLink1Description: Website Link; ComponentLink1URL: https://www.we-online.com/redexpert/article/430456043736?ad; ComponentLink2Description: Datasheet Link; ComponentLink2URL: https://www.we-online.com/redexpert/spec/430456043736?ad; Manufacturer Part Number: 430456043736; Category: Tact Switches; Match Code: WS-TATV; Mount: Through Hole; Operating Temperature Max: 85°C; Operating Temperature Min: -40°C; Packaging: Bulk; Length: 12mm; Width: 12mm; Height: 4.3mm; Circuit: SPST-NO; Contact Material: Stainless Steel; Contact Plating: Silver; Operation Force: 360g; Rated Current: 50mA; Rated Voltage: 12VDC; Terminal Material: Copper Alloy; Terminal Plating: Silver
U4-U7 = SN74AHC1G09DBVR: Logic Gate Sgl 2Inp Pos-AND Gate; Manufacturer_Name: Texas Instruments; Datasheet Link: http://www.ti.com/lit/gpn/sn74ahc1g09; Height: 1.45mm; Manufacturer_Part_Number: SN74AHC1G09DBVR; Mouser Part Number: 595-SN74AHC1G09DBVR; Mouser Price/Stock: https://www.mouser.co.uk/ProductDetail/Texas-Instruments/SN74AHC1G09DBVR?qs=SMj%252Bbyv09TwoyWK2f6L9Mg%3D%3D; Arrow Part Number: SN74AHC1G09DBVR; Arrow Price/Stock: https://www.arrow.com/en/products/sn74ahc1g09dbvr/texas-instruments?region=nac
VR1 VR2 = CG0603MLC-05E: Varistor CG0603MLC-05E; Manufacturer_Name: Bourns; Datasheet Link: http://www.farnell.com/datasheets/1785244.pdf; Height: 0.55mm; Manufacturer_Part_Number: CG0603MLC-05E; Mouser Part Number: 652-CG0603MLC-05E; Mouser Price/Stock: https://www.mouser.co.uk/ProductDetail/Bourns/CG0603MLC-05E?qs=lDok7oSghXVLNKMK69q%252BFQ%3D%3D; Arrow Part Number: CG0603MLC-05E; Arrow Price/Stock: https://www.arrow.com/en/products/cg0603mlc-05e/bourns?region=nac
Y1 Y2 = ABM7-16.000MHZ-D2Y-T: Crystal or Oscillator; Manufacturer_Name: ABRACON; Datasheet Link: https://abracon.com/Resonators/abm7.pdf; Height: 1.4mm; Manufacturer_Part_Number: ABM7-16.000MHZ-D2Y-T; Mouser Part Number: 815-ABM7-16-D2Y-T; Mouser Price/Stock: https://www.mouser.co.uk/ProductDetail/ABRACON/ABM7-16.000MHZ-D2Y-T?qs=LoTOQoUkC8QdlhlqgnS4cw%3D%3D; Arrow Part Number: ABM7-16.000MHZ-D2Y-T; Arrow Price/Stock: https://www.arrow.com/en/products/abm7-16.000mhz-d2y-t/abracon?region=nac